# EAGLE schematic SparkFun_Main_Board_Single_v20 (EAGLE 9.6.2)
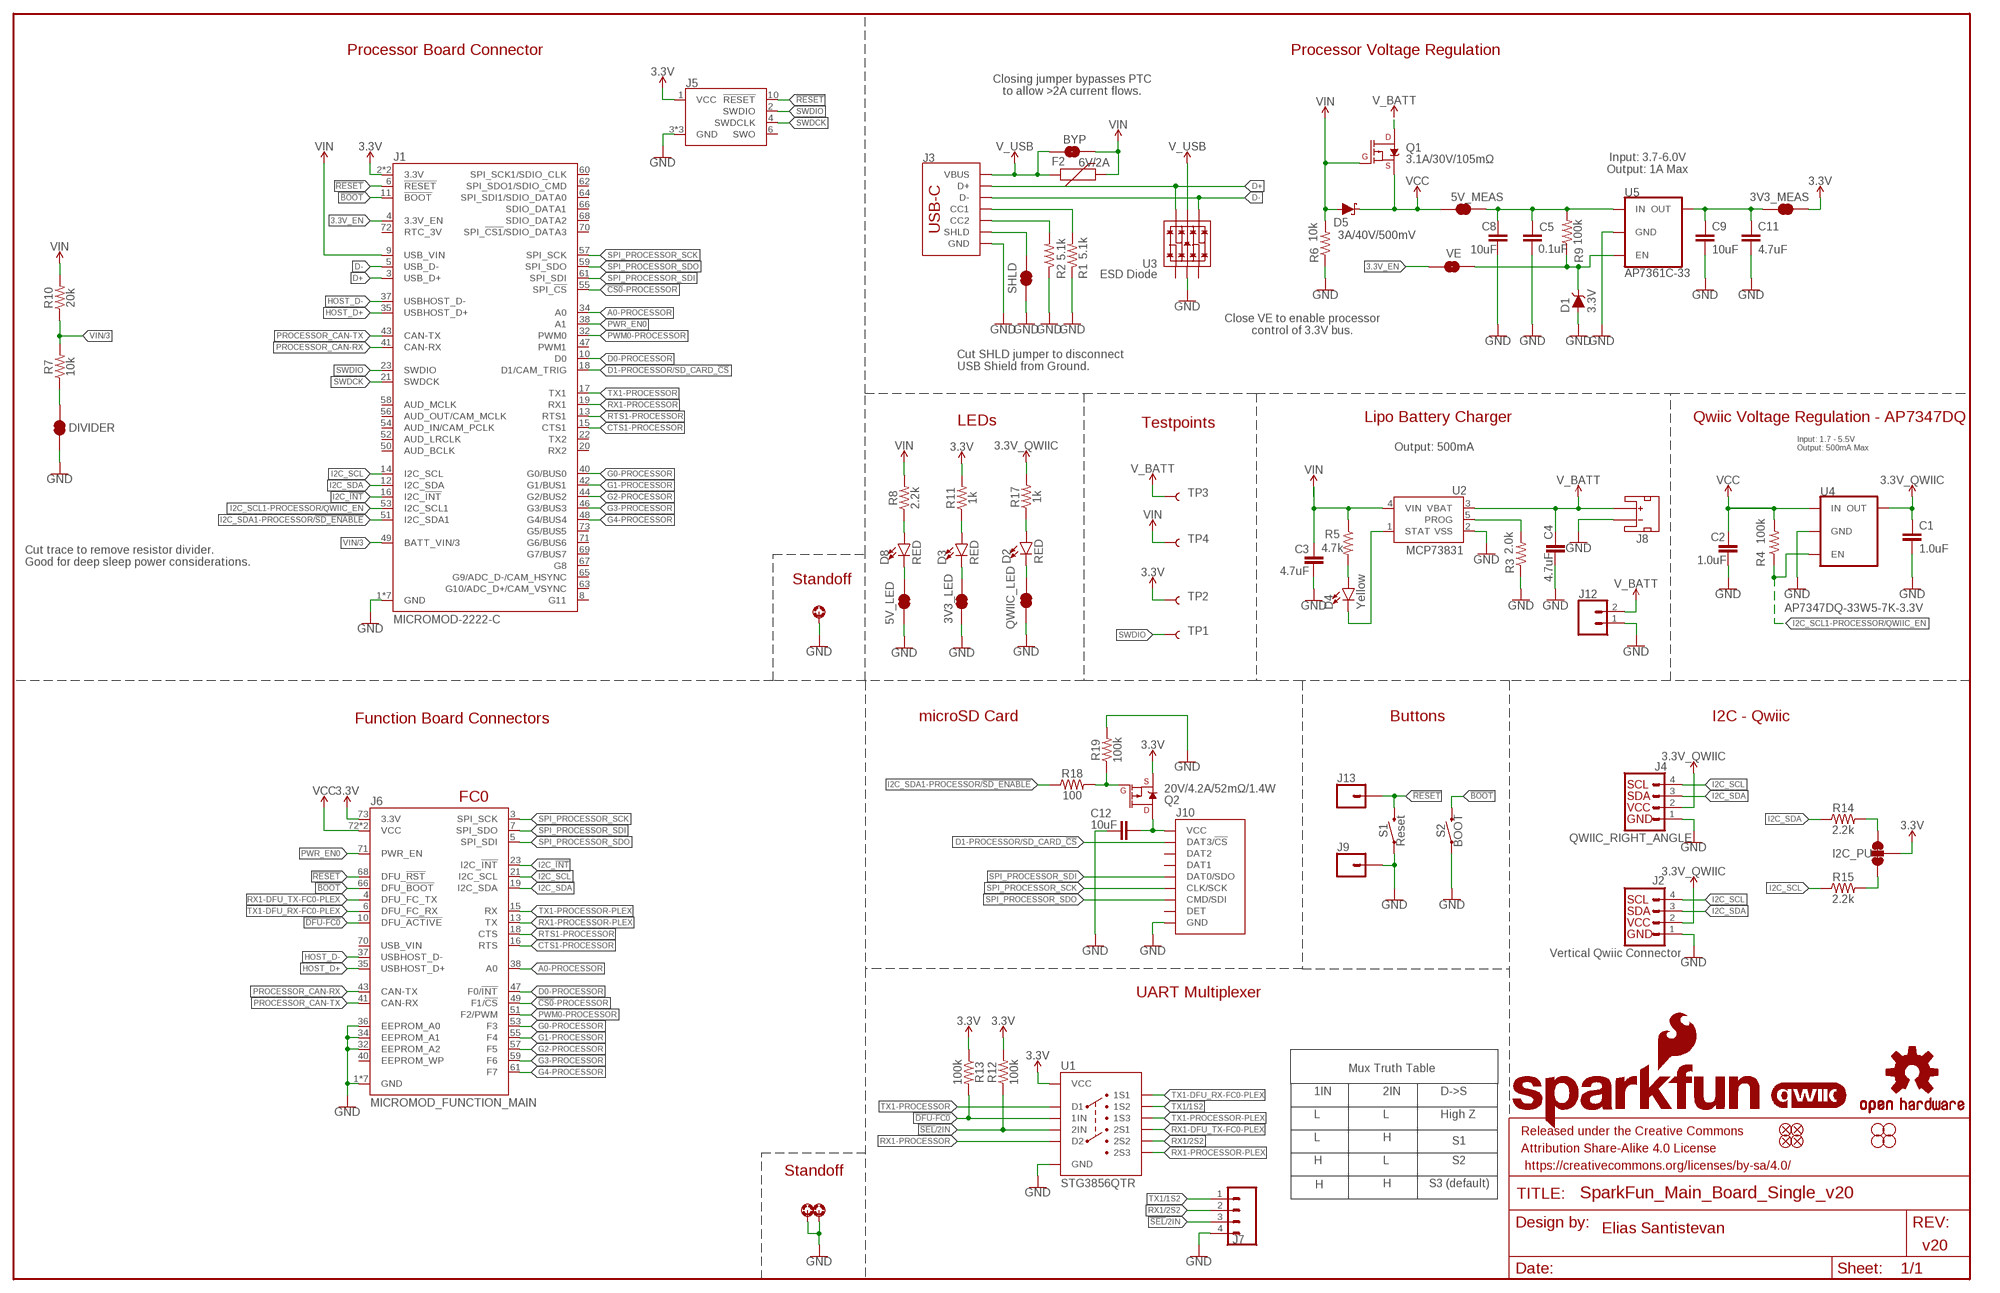
[diagram p0: schematic, sheet 1]

## Parts
3V3_LED  JUMPER-SMT_2_NC_TRACE_SILK  [SMT-JUMPER_2_NC_TRACE_SILK]
3V3_MEAS  JUMPER-COMBO_2_NC_TRACE  [COMBO-JUMPER_2_NC_TRACE]
5V_LED  JUMPER-SMT_2_NC_TRACE_SILK  [SMT-JUMPER_2_NC_TRACE_SILK]
5V_MEAS  JUMPER-COMBO_2_NC_TRACE  [COMBO-JUMPER_2_NC_TRACE]
BYP  JUMPER-SMT_2_NO_SILK  [SMT-JUMPER_2_NO_SILK]
C1  1.0uF  1.0UF-0603-16V-10%  [0603]
C2  1.0uF  1.0UF-0603-16V-10%  [0603]
C3  4.7uF  4.7UF-0603-6.3V-(10%)  [0603]
C4  4.7uF  4.7UF-0603-35V-(20%)  [0603]
C5  0.1uF  0.1UF-0603-25V-(+80/-20%)  [0603]
C8  10uF  10UF-0805-10V-10%  [0805]
C9  10uF  10UF-0603-6.3V-20%  [0603]
C11  4.7uF  4.7UF-0603-6.3V-(10%)  [0603]
C12  10uF  10UF-0603-6.3V-20%  [0603]
D1  3.3V  DIODE-ZENER-MM3Z3V3T1G  [SOD-323]
D2  RED  LED-RED0603  [LED-0603]
D3  RED  LED-RED0603  [LED-0603]
D4  Yellow  LED-YELLOW0603  [LED-0603]
D5  3A/40V/500mV  DIODE-SCHOTTKY-B340A  [SMA-DIODE]
D8  RED  LED-RED0603  [LED-0603]
DIVIDER  JUMPER-SMT_2_NC_TRACE_SILK  [SMT-JUMPER_2_NC_TRACE_SILK]
F2  6V/2A  PPTC_6V2A  [1210]
FD1  FIDUCIAL1X2  [FIDUCIAL-1X2]
FD2  FIDUCIAL1X2  [FIDUCIAL-1X2]
FD3  FIDUCIAL1X2  [FIDUCIAL-1X2]
FD4  FIDUCIAL1X2  [FIDUCIAL-1X2]
FRAME1  FRAME-LEDGER  [CREATIVE_COMMONS]
H2  STAND-OFF-REFLOW-M2.5_2.5MM_TALL  [STAND-OFF-REFLOW-M2.5]
H4  STAND-OFF-REFLOW-M2.5_2.5MM_TALL  [STAND-OFF-REFLOW-M2.5]
H8  STAND-OFF-REFLOW-M2.5_2.5MM_TALL  [STAND-OFF-REFLOW-M2.5]
H14  STAND-OFFTIGHT  [STAND-OFF-TIGHT]
H15  STAND-OFFTIGHT  [STAND-OFF-TIGHT]
H16  STAND-OFFTIGHT  [STAND-OFF-TIGHT]
H17  STAND-OFFTIGHT  [STAND-OFF-TIGHT]
I2C_PU  JUMPER-SMT_3_2-NC_TRACE_SILK  [SMT-JUMPER_3_2-NC_TRACE_SILK]
J1  MICROMOD-2222-C  [M.2-CONNECTOR-E]
J2  Vertical Qwiic Connector  QWIIC_CONNECTOR  [JST04_1MM_VERT]
J3  USB_C_2-LAYER_PADS  [USB-C-16P-2LAYER-PADS]
J4  QWIIC_RIGHT_ANGLE  QWIIC_CONNECTORJS-1MM  [JST04_1MM_RA]
J5  CORTEX_JTAG_DEBUG_MINIMUM_PTH  [2X5-PTH-1.27MM]
J6  MICROMOD_FUNCTION_MAIN  [M.2-CONNECTOR-E-FUNCTION-STANDARD]
J7  CONN_041X04_NO_SILK  [1X04_NO_SILK]
J8  JST_2MM_MALE  [JST-2-SMD]
J9  CONN_01PTH_NO_SILK_YES_STOP  [1X01_NO_SILK]
J10  MICRO-SD-PUSH-PUSH-EXT-PIN  [MICROSD-EXTERNALPIN]
J12  CONN_021X02_NO_SILK  [1X02_NO_SILK]
J13  CONN_01PTH_NO_SILK_YES_STOP  [1X01_NO_SILK]
LOGO1  QWIIC_LOGO_8MM  [QWIIC_8MM]
LOGO2  SFE_LOGO_NAME_FLAME.3_INCH  [SFE_LOGO_NAME_FLAME_.3]
LOGO3  OSHW-LOGOL  [OSHW-LOGO-L]
Q1  3.1A/30V/105mΩ  MOSFET_PCH-DMG2307L  [SOT23-3]
Q2  20V/4.2A/52mΩ/1.4W  MOSFET_PCH-DMG2305UX-7  [SOT23-3]
QWIIC_LED  JUMPER-SMT_2_NC_TRACE_SILK  [SMT-JUMPER_2_NC_TRACE_SILK]
R1  5.1k  5.1KOHM5.1KOHM-0603-1/10W-1%  [0603]
R2  5.1k  5.1KOHM5.1KOHM-0603-1/10W-1%  [0603]
R3  2.0k  2.0KOHM-0603-1/10W-5%  [0603]
R4  100k  100KOHM-0603-1/10W-1%  [0603]
R5  4.7k  4.7KOHM-0603-1/10W-1%  [0603]
R6  10k  10KOHM-0603-1/10W-1%  [0603]
R7  10k  10KOHM-0603-1/10W-1%  [0603]
R8  2.2k  2.2KOHM-0603-1/10W-1%  [0603]
R9  100k  100KOHM-0603-1/10W-1%  [0603]
R10  20k  20KOHM-0603-1/10W-1%  [0603]
R11  1k  1KOHM-0603-1/10W-1%  [0603]
R12  100k  100KOHM-0603-1/10W-1%  [0603]
R13  100k  100KOHM-0603-1/10W-1%  [0603]
R14  2.2k  2.2KOHM-0603-1/10W-1%  [0603]
R15  2.2k  2.2KOHM-0603-1/10W-1%  [0603]
R17  1k  1KOHM-0603-1/10W-1%  [0603]
R18  100  100OHM-0603-1/10W-1%  [0603]
R19  100k  100KOHM-0603-1/10W-1%  [0603]
S1  Reset  MOMENTARY-SWITCH-SPST-SMD-5.2-TALL-REDUNDANT  [TACTILE_SWITCH_SMD_5.2MM]
S2  BOOT  MOMENTARY-SWITCH-SPST-SMD-5.2-TALL-REDUNDANT  [TACTILE_SWITCH_SMD_5.2MM]
SHLD  JUMPER-SMT_2_NC_TRACE_SILK  [SMT-JUMPER_2_NC_TRACE_SILK]
TP1  TEST-POINT3X5  [PAD.03X.05]
TP2  TEST-POINT3X5  [PAD.03X.05]
TP3  TEST-POINT3X5  [PAD.03X.05]
TP4  TEST-POINT3X5  [PAD.03X.05]
U1  STG3856QTR  [STG3856]
U2  MCP73831  [SOT23-5]
U3  ESD Diode  TVS_DIODE_ARRAYSMD  [SOT-23-6]
U4  AP7347DQ-33W5-7K-3.3V  [SOT25]
U5  AP7361C-33  AP7361C-33FGEUDFN-8  [UDFN-8]
VE  JUMPER-SMT_2_NO_SILK  [SMT-JUMPER_2_NO_SILK]

## Nets
3.3V [POWER]: 3V3_MEAS.2 3V3_MEAS.4 I2C_PU.2 J1.2(3.3V) J1.74(3.3V) J5.1(VCC) J6.73(3.3V) Q2.2(S) R11.2 R12.2 R13.1 TP2.1 U1.P11(VCC)
3.3V_EN: J1.4(3.3V_EN) VE.1
3.3V_EN_VE: D1.C R9.1 U5.5(EN) VE.2
3.3V_QWIIC: C1.1 J2.2 J4.2 R17.2 U4.5(OUT)
3V3_MEAS: 3V3_MEAS.1 3V3_MEAS.3 C9.1 C11.1 U5.1(OUT)
!BOOT!: J1.11(!BOOT!) J6.66(DFU_!BOOT!) S2.3 S2.4
!CS0!-PROCESSOR: J1.55(SPI_!CS!) J6.49(F1/!CS!)
!DFU-FC0!: J6.10(DFU_!ACTIVE!) R13.2 U1.P12(1IN)
!RESET!: J1.6(!RESET!) J5.10(!RESET) J6.68(DFU_!RST!) J13.1 S1.3 S1.4
!SEL!/2IN: J7.3 R12.1 U1.P10(2IN)
A0-PROCESSOR: J1.34(A0) J6.38(A0)
CTS1-PROCESSOR: J1.15(CTS1) J6.16(RTS)
D0-PROCESSOR: J1.10(D0) J6.47(F0/!INT!)
D1-PROCESSOR/SD_CARD_!CS!: J1.18(D1/CAM_TRIG) J10.2(DAT3/!CS!)
D+ [Diff pairs]: J1.3(USB_D+) J3.A6(D+) J3.B6(D+) U3.6(IO4)
D- [Diff pairs]: J1.5(USB_D-) J3.A7(D-) J3.B7(D-) U3.4(IO3)
G0-PROCESSOR: J1.40(G0/BUS0) J6.53(F3)
G1-PROCESSOR: J1.42(G1/BUS1) J6.55(F4)
G2-PROCESSOR: J1.44(G2/BUS2) J6.57(F5)
G3-PROCESSOR: J1.46(G3/BUS3) J6.59(F6)
G4-PROCESSOR: J1.48(G4/BUS4) J6.61(F7)
GND: 3V3_LED.1 5V_LED.1 C1.2 C2.2 C3.2 C4.2 C5.2 C8.2 C9.2 C11.2 C12.2 D1.A DIVIDER.1 H2.1 H4.1 H8.1 J1.1(GND) J1.7(GND) J1.33(GND) J1.36(GND) J1.39(GND) J1.45(GND) J1.75(GND) J2.1 J3.GND J3.GND2(GND) J4.1 J5.3(GND) J5.5(GND) J5.9(GND) J6.1(GND) J6.2(GND) J6.8(GND) J6.32(EEPROM_A2) J6.33(GND) J6.34(EEPROM_A1) J6.36(EEPROM_A0) J6.39(GND) J6.45(GND) J6.75(GND) J7.4 J8.1(-) J9.1 J10.6(GND) J10.10(GND) J10.11(GND) J10.12(GND) J10.13(GND) J12.1 QWIIC_LED.1 R1.1 R2.1 R3.1 R6.1 R19.2 S1.1 S1.2 S2.1 S2.2 SHLD.1 U1.P5(GND) U2.2(VSS) U3.2(VSS) U4.2(GND) U5.4(GND) U5.EP(GND)
HOST_D+ [Diff pairs]: J1.35(USBHOST_D+) J6.35(USBHOST_D+)
HOST_D- [Diff pairs]: J1.37(USBHOST_D-) J6.37(USBHOST_D-)
I2C_!INT!: J1.16(I2C_!INT!) J6.23(I2C_!INT!)
I2C_SCL: J1.14(I2C_SCL) J2.4 J4.4 J6.21(I2C_SCL) R15.1
I2C_SCL1-PROCESSOR/QWIIC_EN: J1.53(I2C_SCL1) R4.1 U4.3(EN)
I2C_SDA: J1.12(I2C_SDA) J2.3 J4.3 J6.19(I2C_SDA) R14.1
I2C_SDA1-PROCESSOR/!SD_ENABLE!: J1.51(I2C_SDA1) R18.1
N$2: 5V_LED.2 D8.C
N$3: D3.A R11.1
N$4: J3.B5(CC2) R2.2
N$5: J3.A5(CC1) R1.2
N$6: R3.2 U2.5(PROG)
N$7: DIVIDER.2 R7.1
N$8: D4.C U2.1(STAT)
N$9: D4.A R5.2
N$10: 3V3_LED.2 D3.C
N$11: I2C_PU.3 R14.2
N$12: D8.A R8.1
N$13: I2C_PU.1 R15.2
N$14: D2.A R17.1
N$15: D2.C QWIIC_LED.2
N$16 [POWER]: C12.1 J10.4(VCC) Q2.3(D)
N$18: Q2.1(G) R18.2 R19.1
PROCESSOR_CAN-RX: J1.41(CAN-RX) J6.43(CAN-TX)
PROCESSOR_CAN-TX: J1.43(CAN-TX) J6.41(CAN-RX)
PWM0-PROCESSOR: J1.32(PWM0) J6.51(F2/PWM)
PWR_EN0: J1.38(A1) J6.71(PWR_EN)
RTS1-PROCESSOR: J1.13(RTS1) J6.18(CTS)
RX1-DFU_TX-FC0-PLEX: J6.4(DFU_FC_TX) U1.P9(2S1)
RX1-PROCESSOR: J1.19(RX1) U1.P6(D2)
RX1-PROCESSOR-PLEX: J6.13(TX) U1.P7(2S3)
RX1/2S2: J7.2 U1.P8(2S2)
SHLD: J3.SHLD1(SHLD) J3.SHLD2(SHLD) J3.SHLD3(SHLD) J3.SHLD4(SHLD) SHLD.2
SPI_PROCESSOR_SCK: J1.57(SPI_SCK) J6.3(SPI_SCK) J10.5(CLK/SCK)
SPI_PROCESSOR_SDI: J1.61(SPI_SDI) J6.7(SPI_SDO) J10.7(DAT0/SDO)
SPI_PROCESSOR_SDO: J1.59(SPI_SDO) J6.5(SPI_SDI) J10.3(CMD/SDI)
SWDCK: J1.21(SWDCK) J5.4(SWDCLK)
SWDIO: J1.23(SWDIO) J5.2(SWDIO) TP1.1
TX1-DFU_RX-FC0-PLEX: J6.6(DFU_FC_RX) U1.P1(1S1)
TX1-PROCESSOR: J1.17(TX1) U1.P4(D1)
TX1-PROCESSOR-PLEX: J6.15(RX) U1.P3(1S3)
TX1/1S2: J7.1 U1.P2(1S2)
V_BATT [POWER]: C4.1 J8.2(+) J12.2 Q1.3(D) TP3.1 U2.3(VBAT)
V_USB: BYP.1 F2.1 J3.VBUS1(VBUS) J3.VBUS2(VBUS) U3.5(VCC)
VCC: 5V_MEAS.1 5V_MEAS.3 C2.1 D5.C J6.72(VCC) J6.74(VCC) Q1.2(S) R4.2 U4.1(IN)
VCC_MEAS: 5V_MEAS.2 5V_MEAS.4 C5.1 C8.1 R9.2 U5.8(IN)
VIN: BYP.2 C3.1 D5.A F2.2 J1.9(USB_VIN) Q1.1(G) R5.1 R6.2 R8.2 R10.2 TP4.1 U2.4(VIN)
VIN/3: J1.49(BATT_VIN/3) R7.2 R10.1
Unconnected: J1.8(G11) J1.20(RX2) J1.22(TX2) J1.47(PWM1) J1.50(AUD_BCLK) J1.52(AUD_LRCLK) J1.54(AUD_IN/CAM_PCLK) J1.56(AUD_OUT/CAM_MCLK) J1.58(AUD_MCLK) J1.60(SPI_SCK1/SDIO_CLK) J1.62(SPI_SDO1/SDIO_CMD) J1.63(G10/ADC_D+/CAM_VSYNC) J1.64(SPI_SDI1/SDIO_DATA0) J1.65(G9/ADC_D-/CAM_HSYNC) J1.66(SDIO_DATA1) J1.67(G8) J1.68(SDIO_DATA2) J1.69(G7/BUS7) J1.70(SPI_!CS1!/SDIO_DATA3) J1.71(G6/BUS6) J1.72(RTC_3V) J1.73(G5/BUS5) J5.6(SWO) J6.40(EEPROM_WP) J6.70(USB_VIN) J8.NC1(PAD1) J8.NC2(PAD2) J10.1(DAT2) J10.8(DAT1) J10.9(DET) U3.1(IO1) U3.3(IO2)

## Notes on the sheet
- Processor Board Connector | Processor Voltage Regulation
- Closing jumper bypasses PTC
  to allow >2A current flows.
- Input: 3.7-6.0V
  Output: 1A Max
- Close VE to enable processor
  control of 3.3V bus.
- Cut SHLD jumper to disconnect
  USB Shield from Ground.
- Lipo Battery Charger | Qwiic Voltage Regulation - AP7347DQ
- LEDs | Testpoints
- Output: 500mA
- Input: 1.7 - 5.5V
  Output: 500mA Max
- Cut trace to remove resistor divider.
  Good for deep sleep power considerations.
- Standoff
- Function Board Connectors | microSD Card | Buttons | I2C - Qwiic
- FC0
- UART Multiplexer
- Mux Truth Table
- 1IN | 2IN | D->S
- L | L | High Z
- L | H
- S1
- H | L | S2
- Standoff
- H | H | S3 (default)
- Elias Santistevan
- v20

## Library data of the parts
3V3_LED 5V_LED DIVIDER QWIIC_LED SHLD = SparkFun-Jumpers:JUMPER-SMT_2_NC_TRACE: Normally closed trace jumper This jumper has a trace between two pads so it's normally closed (NC). Use a razor knife to open the connection. For best results follow the IPC guidelines for cutting traces: Cutout at least 0.063 mm (0.005 in). Remove all loose material to clean up the cut area. Seal the cut with an approved epoxy. Reapply solder to reclose the connection.
3V3_MEAS 5V_MEAS = SparkFun-Jumpers:JUMPER-COMBO_2_NC_TRACE
BYP VE = SparkFun-Jumpers:JUMPER-SMT_2_NO: Normally open jumper This jumper has two pads in close proximity to each other. Apply solder to close the connection. Round pads are easier to solder for beginners, but are a lot larger. SparkFun Product that uses the round pads: SparkFun EL Sequencer <https://www.sparkfun.com/products/12781>
C1 C2 = SparkFun-Capacitors:1.0UF: 1µF ceramic capacitors A capacitor is a passive two-terminal electrical component used to store electrical energy temporarily in an electric field.; PROD_ID: CAP-00868
C3 C11 = SparkFun-Capacitors:4.7UF: 4.7µF ceramic capacitors A capacitor is a passive two-terminal electrical component used to store electrical energy temporarily in an electric field.; PROD_ID: CAP-08280
C4 = SparkFun-Capacitors:4.7UF: 4.7µF ceramic capacitors A capacitor is a passive two-terminal electrical component used to store electrical energy temporarily in an electric field.; PROD_ID: CAP-14106
C5 = SparkFun-Capacitors:0.1UF: 0.1µF ceramic capacitors A capacitor is a passive two-terminal electrical component used to store electrical energy temporarily in an electric field.; PROD_ID: CAP-00810
C8 = SparkFun-Capacitors:10UF: 10.0µF ceramic capacitors A capacitor is a passive two-terminal electrical component used to store electrical energy temporarily in an electric field.; PROD_ID: CAP-11330
C9 C12 = SparkFun-Capacitors:10UF: 10.0µF ceramic capacitors A capacitor is a passive two-terminal electrical component used to store electrical energy temporarily in an electric field.; PROD_ID: CAP-11015
D1 = SparkFun-DiscreteSemi:DIODE-ZENER: Zener Diode A Zener diode allows current to flow from its anode to its cathode like a normal semiconductor diode, but it also permits current to flow in the reverse direction when its "Zener voltage" is reached. - WIkipedia; PROD_ID: DIO-11284
D2 D3 D8 = SparkFun-LED:LED-RED: Red SMD LED Used in manufacturing of most products at SparkFun Packages: 0603 - SMD 0603 package [Product Link] <http://docs.avagotech.com/docs/AV02-0551EN> 0603 SMART - SMD 0603 SMART package ( more efficient and expensive)[Product Link] <http://www.osram-os.com/Graphics/XPic2/00077099_0.pdf> 1206 - SMD1206 package [Product Link] <https://www.sparkfun.com/datasheets/DevTools/LilyPad/Q150OVS4.pdff> SparkFun Products: Pro Mini 328 -5V <https://www.sparkfun.com/products/821> RedBoard <https://www.sparkfun.com/products/12757> IOIO-OTG <https://www.sparkfun.com/products/13613>; PROD_ID: DIO-00819
D4 = SparkFun-LED:LED-YELLOW: Yellow SMD LED Used in manufacturing several products at SparkFun. Packages: 0603 - SMD 0603 package[Product Link] <http://www.kingbrightusa.com/product.asp?catalog_name=LED&product_id=APT1608SYCK> 0603 -SMART - SMART SMD 0603 package (more efficient/more expensive) [Product Link] <http://www.osram-os.com/osram_os/en/products/product-catalog/led-light-emitting-diodes/smartled-0603/ly-l29k/index.jsp> LilyPad - SMD1206 package[Product Datasheet] <https://www.sparkfun.com/datasheets/DevTools/LilyPad/Q150YUS4.pdf> SparkFun Products: Blynk Board <https://www.sparkfun.com/products/13794> IOIO-OTG <https://www.sparkfun.com/products/13613> XBee Explorer Serial <https://www.sparkfun.com/products/13225>; PROD_ID: DIO-09003
D5 = SparkFun-DiscreteSemi:DIODE-SCHOTTKY: Schottky diode A Schottky diode is a semiconductor diode which has a low forward voltage drop and a very fast switching action.; PROD_ID: DIO-09886
F2 = SparkFun-Fuses:PPTC: Resettable Fuse PPTC Resettable Fuse. Really a sort of resistor with a polymeric positive temperature coefficient whose resistance increases dramatically with an increase in temperature. When heated by the power passing through the resistance rises causing the current to be limited, protecting the circuit. This is achieved by the transition of the polymer from a crystalline to an amorphous state where the conductive carbon separates breaking the conductive pathways found in the cool crystalline structure. When a PPTC cools back down it resumes conducting letting the circuit turn back on. SparkFun Products: SparkFun RedBoard - Programmed with Arduino <https://www.sparkfun.com/products/12757> Pro Micro - 5V/16MHz <https://www.sparkfun.com/products/12640> Arduino Pro 328 - 5V/16MHz <https://www.sparkfun.com/products/10915> MP3 Trigger <https://www.sparkfun.com/products/13720>; PROD_ID: RES-14313
FD1-FD4 = SparkFun-Aesthetics:FIDUCIAL: Fiducial Alignment Points Point-of-reference for pick-and-place machines and other optical instruments.
FRAME1 = SparkFun-Aesthetics:FRAME-LEDGER: Schematic Frame - Ledger Standard 11x14 US Ledger frame
H2 H4 H8 = SparkFun-Hardware:STAND-OFF-REFLOW: Stand Off Reflow Compatible A metal standoff that can be placed and reflowed onto a PCB. The M2.5 x 2.5mm variant is used on MicroMod. The M2.5 x 1.5mm variant is used to hold mPCIe boards, including the Swarm M138. The M2.0 x 6.0mm variant is used to mount the Iridium 9603N modem.; PROD_ID: HW-14899
H14-H17 = SparkFun-Hardware:STAND-OFF: Stand Off Drill holes for mechanically mounting via screws, standoffs, etc. Note: Use the keepout ring to avoid running the screw head into surrounding components. Variant Overviews STAND-OFF - Mechanical footprint for a #4 phillips button head screw. STAND-OFF-TIGHT - Mechanical footprint for a #4 phillips button head screw, Example SparkFun Products Screw - Phillips Head (1/4", 4-40, 10 pack) <https://www.sparkfun.com/products/10453> (PRT-10453) Screw - Phillips Head (1/2", 4-40, 10 pack) <https://www.sparkfun.com/products/10452> (PRT-10452) Screw - Phillips Head (3/4", 4-40, 10 pack) <https://www.sparkfun.com/products/10451> (PRT-10451) Screw - Phillips Head (1", 4-40, 10 pack) <https://www.sparkfun.com/products/10450> (PRT-10450)
I2C_PU = SparkFun-Jumpers:JUMPER-SMT_3_2-NC_TRACE: Normally closed trace jumper (2 of 2 connections) This jumper has a trace between all three pads so they are normally closed (NC). Use a razor knife to open the connection(s). For best results follow the IPC guidelines for cutting traces: Cutout at least 0.063 mm (0.005 in). Remove all loose material to clean up the cut area. Seal the cut with an approved epoxy. Reapply solder to reclose the connection(s).
J1 = SparkFun-MicroMod:MICROMOD: MicroMod Connector Description: A card edge connector and mating PCB connector to allow various MicroMod Processor Boards to be coupled with various carrier boards of different capabilities. Based on the M.2 standard.; PROD_ID: CONN-14877
J2 = SparkFun-Connectors:QWIIC_CONNECTOR: SparkFun I2C Standard Qwiic Connector An SMD 1mm pitch JST connector makes it easy and quick (get it? Qwiic?) to connect I2C devices to each other. The Qwiic system <http://www.sparkfun.com/qwiic> enables fast and solderless connection between popular platforms and various sensors and actuators. We carry 200mm <https://www.sparkfun.com/products/14204>, 100mm <https://www.sparkfun.com/products/14205>, 50mm <https://www.sparkfun.com/products/14206>, and breadboard friendly <https://www.sparkfun.com/products/14207> Qwiic cables. We also offer 10 pcs strips <https://www.sparkfun.com/products/14323> the SMD connectors.; PROD_ID: CONN-14483
J3 = SparkFun-Connectors:USB_C: USB Type C 16Pin Connector Super Speed pins not available on the 16-pin purely SMD connector so this part is best for USB 2.0 implementations. D1 and D2 are tied together enabling D+/- no matter which way the cable is plugged into the connector. The two channel configuration pins (CC1/2) are exposed. These are normally connected to ground via 5.1k resistors but can be reconfigured for high current/high power applications. **4-LAYER BOARD WARNING!!** If designing 4-layer board, make sure to select the variant _4-LAYER-ISOLATED. The linked footprint (USB-C-16-4LAYER-ISOLATED) includes some very necessary cutout polygons in the inner layers (2 and 15). This prevents the PTH mounting shield legs on the USB connector from electrically connecting any other polygons on the inner layers (usually VCC and GND).; PROD_ID: CONN-14122
J4 = SparkFun-Connectors:QWIIC_CONNECTOR: SparkFun I2C Standard Qwiic Connector An SMD 1mm pitch JST connector makes it easy and quick (get it? Qwiic?) to connect I2C devices to each other. The Qwiic system <http://www.sparkfun.com/qwiic> enables fast and solderless connection between popular platforms and various sensors and actuators. We carry 200mm <https://www.sparkfun.com/products/14204>, 100mm <https://www.sparkfun.com/products/14205>, 50mm <https://www.sparkfun.com/products/14206>, and breadboard friendly <https://www.sparkfun.com/products/14207> Qwiic cables. We also offer 10 pcs strips <https://www.sparkfun.com/products/14323> the SMD connectors.; PROD_ID: CONN-13694
J5 = SparkFun-Connectors:CORTEX_JTAG_DEBUG_MINIMUM: Cortex Debug Connector - 10 pin Supports JTAG debug, Serial Wire debug, and Serial Wire Viewer. PTH and SMD connector options available. General Connector Information <http://infocenter.arm.com/help/topic/com.arm.doc.faqs/attached/13634/cortex_debug_connectors.pdf> Products: PTH Connector <http://www.digikey.com/product-detail/en/cnc-tech/3220-10-0100-00/1175-1627-ND/3883661> -via Digi-Key SparkFun PSoc <https://www.sparkfun.com/products/13229> SparkFun T <https://www.sparkfun.com/products/13810>
J6 = SparkFun-MicroMod:MICROMOD_FUNCTION: MicroMod Connector Description: A card edge connector and mating PCB connector to allow various MicroMod Processor Boards to be coupled with various carrier boards of different capabilities. Based on the M.2 standard.; PROD_ID: CONN-14877
J7 = SparkFun-Connectors:CONN_04: Multi connection point. Often used as Generic Header-pin footprint for 0.1 inch spaced/style header connections On any of the 0.1 inch spaced packages, you can populate with these: Break Away Headers - Straight <https://www.sparkfun.com/products/116> (PRT-00116) Break Away Male Headers - Right Angle <https://www.sparkfun.com/products/553> (PRT-00553) Female Headers <https://www.sparkfun.com/products/115> (PRT-00115) Break Away Headers - Machine Pin <https://www.sparkfun.com/products/117> (PRT-00117) Break Away Female Headers - Swiss Machine Pin <https://www.sparkfun.com/products/743> (PRT-00743) For SCREWTERMINALS and SPRING TERMINALS visit here: Screw Terimnals on SparkFun.com <https://www.sparkfun.com/search/results?term=Screw+Terminals> (5mm/3.5mm/2.54mm spacing) This device is also useful as a general connection point to wire up your design to another part of your project. Our various solder wires solder well into these plated through hole pads. Hook-Up Wire - Assortment (Stranded, 22 AWG) <https://www.sparkfun.com/products/11375> (PRT-11375) Hook-Up Wire - Assortment (Solid Core, 22 AWG) <https://www.sparkfun.com/products/11367> (PRT-11367) View the entire wire category on our website here <https://www.sparkfun.com/categories/141> Special notes: Molex polarized connector foot print use with SKU : PRT-08231 with associated crimp pins and housings. 1MM SMD Version SKU: PRT-10208; PROD_ID: CONN-09696
J8 = SparkFun-Connectors:JST_2MM_MALE: JST 2MM MALE RA CONNECTOR Two pin, compact surface mount connector. Commonly used as a battery input connection point. We really like the solid locking feeling and high current rating on these small connectors. We use these all the time as battery connectors. Mates to single-cell LiPo batteries. Here is the connector we sell at SparkFun: JST Right Angle Connector - White <https://www.sparkfun.com/products/8612> (PRT-08612) Datasheet <http://www.sparkfun.com/datasheets/Prototyping/Connectors/JST-Horizontal.pdf> It was used on these SparkFun products: SparkFun MOSFET Power Controller <https://www.sparkfun.com/products/11214> (PRT-11214) SparkFun Battery Babysitter - LiPo Battery Manager <https://www.sparkfun.com/products/13777> (PRT-13777) And many, many others that required a lipo battery connection.; PROD_ID: CONN-11443; SF_ID: PRT-08612
J9 J13 = SparkFun-Connectors:CONN_01: Single connection point. Often used as Generic Header-pin footprint for 0.1 inch spaced/style header connections On any of the 0.1 inch spaced packages, you can populate with these: Break Away Headers - Straight <https://www.sparkfun.com/products/116> (PRT-00116) Break Away Male Headers - Right Angle <https://www.sparkfun.com/products/553> (PRT-00553) Female Headers <https://www.sparkfun.com/products/115> (PRT-00115) Break Away Headers - Machine Pin <https://www.sparkfun.com/products/117> (PRT-00117) Break Away Female Headers - Swiss Machine Pin <https://www.sparkfun.com/products/743> (PRT-00743) This device is also useful as a general connection point to wire up your design to another part of your project. Our various solder wires solder well into these plated through hole pads. Hook-Up Wire - Assortment (Stranded, 22 AWG) <https://www.sparkfun.com/products/11375> (PRT-11375) Hook-Up Wire - Assortment (Solid Core, 22 AWG) <https://www.sparkfun.com/products/11367> (PRT-11367) View the entire wire category on our website here <https://www.sparkfun.com/categories/141> Special notes: SMTSO-256-ET is a "flush mount" nut for a 4-40 screw. We mostly use this on specialty testbeds; it is a nice way to connect hardware to your PCB at an adjustable hieght. Also note, the SNAP packages are for using a snappable style connector. We sell a baggie of snaps and they are also used on two LilyPad designs: Snap Assortment - 30 pack (male and female) <https://www.sparkfun.com/products/11347> (DEV-11347) LilyPad Arduino SimpleSnap <https://www.sparkfun.com/products/10941> (DEV-10941) LilyPad SimpleSnap Protoboard <https://www.sparkfun.com/products/10940> (DEV-10940)
J10 = SparkFun-Connectors:MICRO-SD: microSD Socket for Transflash Various sockets for µSD. tDoc lines correctly indicate media card edge positions when inserting (unlocked, locked, depressed). NOTE: CD1 and CD2 are connected internally, and the default detect state of the socket is detect pin to ground. SparkFun Products: WAV Trigger <https://www.sparkfun.com/products/13660> CAN-Bus Shield <https://www.sparkfun.com/products/13262> SparkFun Level Shifing microSD Breakout <https://www.sparkfun.com/products/13743>; PROD_ID: CONN-16110
J12 = SparkFun-Connectors:CONN_02: Multi connection point. Often used as Generic Header-pin footprint for 0.1 inch spaced/style header connections On any of the 0.1 inch spaced packages, you can populate with these: Break Away Headers - Straight <https://www.sparkfun.com/products/116> (PRT-00116) Break Away Male Headers - Right Angle <https://www.sparkfun.com/products/553> (PRT-00553) Female Headers <https://www.sparkfun.com/products/115> (PRT-00115) Break Away Headers - Machine Pin <https://www.sparkfun.com/products/117> (PRT-00117) Break Away Female Headers - Swiss Machine Pin <https://www.sparkfun.com/products/743> (PRT-00743) For SCREWTERMINALS and SPRING TERMINALS visit here: Screw Terimnals on SparkFun.com <https://www.sparkfun.com/search/results?term=Screw+Terminals> (5mm/3.5mm/2.54mm spacing) This device is also useful as a general connection point to wire up your design to another part of your project. Our various solder wires solder well into these plated through hole pads. Hook-Up Wire - Assortment (Stranded, 22 AWG) <https://www.sparkfun.com/products/11375> (PRT-11375) Hook-Up Wire - Assortment (Solid Core, 22 AWG) <https://www.sparkfun.com/products/11367> (PRT-11367) View the entire wire category on our website here <https://www.sparkfun.com/categories/141> Special notes: Molex polarized connector foot print use with: PRT-08233 with associated crimp pins and housings. 2.54_SCREWTERM for use with PRT-10571. 3.5mm Screw Terminal footprints for PRT-08084 5mm Screw Terminal footprints for use with PRT-08432
LOGO1 = SparkFun-Aesthetics:QWIIC_LOGO: Qwiic Logos for placement on schematic and PCB. The 5.5mm silk logo is best for placing next to Qwiic connector.
LOGO2 = SparkFun-Aesthetics:SFE_LOGO_NAME_FLAME: SparkFun Font Logo w/ Flame This is the SparkFun full logo. The logo on the schematic will always be the same size; the package variant is the height of the flame part of the logo. Default layer for the logo on the board is tSilk.
LOGO3 = SparkFun-Aesthetics:OSHW-LOGO: Open-Source Hardware (OSHW) Logo This logo indicates the piece of hardware it is found on incorporates a OSHW license and/or adheres to the definition of open source hardware found here: http://freedomdefined.org/OSHW
Q1 = SparkFun-DiscreteSemi:MOSFET_PCH: P-channel MOSFETs Voltage controlled devices that allow control of high current outputs. SparkFun Products: SparkFun ESP32 Thing <https://www.sparkfun.com/products/13907> SparkFun ESP8266 Thing <https://www.sparkfun.com/products/13231> SparkFun Pi Servo HAT V2 <https://www.sparkfun.com/products/15316> DMG2305UX-7 (20V/4.2A/SOT23-3); PROD_ID: TRANS-11308
Q2 = SparkFun-DiscreteSemi:MOSFET_PCH: P-channel MOSFETs Voltage controlled devices that allow control of high current outputs. SparkFun Products: SparkFun ESP32 Thing <https://www.sparkfun.com/products/13907> SparkFun ESP8266 Thing <https://www.sparkfun.com/products/13231> SparkFun Pi Servo HAT V2 <https://www.sparkfun.com/products/15316> DMG2305UX-7 (20V/4.2A/SOT23-3); PROD_ID: TRANS-14388
R1 R2 = SparkFun-Resistors:5.1KOHM; PROD_ID: RES-12083
R3 = SparkFun-Resistors:2.0KOHM: 2kΩ resistor A resistor is a passive two-terminal electrical component that implements electrical resistance as a circuit element. Resistors act to reduce current flow, and, at the same time, act to lower voltage levels within circuits. - Wikipedia; PROD_ID: RES-08296
R4 R9 R12 R13 R19 = SparkFun-Resistors:100KOHM: 100kΩ resistor A resistor is a passive two-terminal electrical component that implements electrical resistance as a circuit element. Resistors act to reduce current flow, and, at the same time, act to lower voltage levels within circuits. - Wikipedia; PROD_ID: RES-07828
R5 = SparkFun-Resistors:4.7KOHM: 4.7kΩ resistor A resistor is a passive two-terminal electrical component that implements electrical resistance as a circuit element. Resistors act to reduce current flow, and, at the same time, act to lower voltage levels within circuits. - Wikipedia; PROD_ID: RES-07857
R6 R7 = SparkFun-Resistors:10KOHM: 10kΩ resistor A resistor is a passive two-terminal electrical component that implements electrical resistance as a circuit element. Resistors act to reduce current flow, and, at the same time, act to lower voltage levels within circuits. - Wikipedia; PROD_ID: RES-00824
R8 R14 R15 = SparkFun-Resistors:2.2KOHM: 2.2kΩ resistor A resistor is a passive two-terminal electrical component that implements electrical resistance as a circuit element. Resistors act to reduce current flow, and, at the same time, act to lower voltage levels within circuits. - Wikipedia; PROD_ID: RES-08272
R10 = SparkFun-Resistors:20KOHM: 20kΩ resistor A resistor is a passive two-terminal electrical component that implements electrical resistance as a circuit element. Resistors act to reduce current flow, and, at the same time, act to lower voltage levels within circuits. - Wikipedia; PROD_ID: RES-09383
R11 R17 = SparkFun-Resistors:1KOHM: 1kΩ resistor A resistor is a passive two-terminal electrical component that implements electrical resistance as a circuit element. Resistors act to reduce current flow, and, at the same time, act to lower voltage levels within circuits. - Wikipedia; PROD_ID: RES-07856
R18 = SparkFun-Resistors:100OHM: 100Ω resistor A resistor is a passive two-terminal electrical component that implements electrical resistance as a circuit element. Resistors act to reduce current flow, and, at the same time, act to lower voltage levels within circuits. - Wikipedia; PROD_ID: RES-07863
S1 S2 = SparkFun-Switches:MOMENTARY-SWITCH-SPST: Momentary Switch (Pushbutton) - SPST Normally-open (NO) SPST momentary switches (buttons, pushbuttons). Variants PTH-12MM - 12mm square, through-hole Momentary Pushbutton Switch - 12mm Square <https://www.sparkfun.com/products/9190> (COM-09190) PTH-6.0MM, PTH-6.0MM-KIT - 6.0mm square, through-hole Mini Pushbutton Switch <https://www.sparkfun.com/products/97> (COM-00097) KIT package intended for soldering kit's - only one side of pads' copper is exposed. PTH-RIGHT-ANGLE-KIT - Right-angle, through-hole Right Angle Tactile Button <https://www.sparkfun.com/products/10791> - Used on SparkFun BigTime Watch Kit <https://www.sparkfun.com/products/11734> SMD-12MM - 12mm square, surface-mount Tactile Button - SMD (12mm) <https://www.sparkfun.com/products/12993> (COM-12993) Used on SparkFun PicoBoard <https://www.sparkfun.com/products/11888> SMD-4.5MM - 4.5mm Square Trackball Switch Used on SparkFun Blackberry Trackballer Breakout <https://www.sparkfun.com/products/13169> SMD-4.6MMX2.8MM - 4.60mm x 2.80mm, surface mount Used on SparkFun Pro Micro - RP2040 <https://www.sparkfun.com/products/17717> SMD-5.2MM, SMD-5.2-REDUNDANT - 5.2mm square, surface-mount Mini Pushbutton Switch - SMD <https://www.sparkfun.com/products/8720> (COM-08720) Used on Arduino Pro Mini <https://www.sparkfun.com/products/11114> REDUNDANT package connects both switch circuits together SMD-6.0X3.5MM - 6.0 x 3.5mm, surface mount Momentary Reset Switch SMD <https://www.sparkfun.com/products/8229> (COM-08229) SMD-6.2MM-TALL - 6.2mm square, surface mount Tactile Button - SMD (6mm) <https://www.sparkfun.com/products/12992> Used on SparkFun Digital Sandbox <https://www.sparkfun.com/products/12651> SMD-RIGHT-ANGLE - Right-angle, surface mount Used on SparkFun Block for Intel® Edison - Arduino <https://www.sparkfun.com/products/13036>; PROD_ID: SWCH-14139
TP1-TP4 = SparkFun-Connectors:TEST-POINT: SparkFun Test Points Bare copper test points for troubleshooting or In-Circuit-Testing. These are used by our Production team for verifying production board runs using pogo-pins on test beds. SparkFun Products: SparkFun LSM9DS1 Breakout <https://www.sparkfun.com/products/13284> SparkFun PSOC <https://www.sparkfun.com/products/13714> SparkFun Load Cell Amplifier <https://www.sparkfun.com/products/13879>
U1 = dip_switch:STG3856QTR; PROD_ID: IC-17058
U2 = SparkFun-IC-Power:MCP73831: MCP73831T Li-Ion, Li-Pol Controller Miniature single cell, fully integrated Li-Ion, Li-polymer charge management controller Datasheet <http://ww1.microchip.com/downloads/en/DeviceDoc/20001984g.pdf> SparkFun Products: SparkFun ESP32 Thing <https://www.sparkfun.com/products/13907> SparkFun 9DoF Razor IMU M0 <https://www.sparkfun.com/products/14001>; PROD_ID: IC-09995
U3 = SparkFun-DiscreteSemi:TVS_DIODE_ARRAY; PROD_ID: IC-13538
U4 = dip_switch:AP7347DQ-33W5-7: AP7347DQ - 500mA CMOS LDO Regulator w/ Enable The AP2112 is CMOS process low dropout linear regulator with enable function, the regulator delivers a guaranteed 600mA (min.) continuous load current. Features Output Voltage Accuracy: ±1% Output Current: 500mA Foldback Short Current Protection: 180mA Enable Function to Turn ON/OFF VOUT Low Dropout Voltage (3.3V): 270mV (Typ.) @IOUT=500mA Excellent Load Regulation: 22.5mV Excellent Line Regulation: 0.02%/V (Typ.) Low Quiescent Current: 60μA (Typ.) Low Standby Current: 0.01μA (Typ.) Low Output Noise: 60μVRMS PSRR: 100Hz -65dB, 1kHz -65dB OTSD Protection Stable with 1.0μF Flexible Cap: Ceramic, Tantalum and Aluminum Electrolytic Operation Temperature Range: -40°C to 85°C ESD: MM 400V, HBM 4000V; PROD_ID: VREG-17101
U5 = SparkFun-IC-Power:AP7361C-33FGE: AP7361C 3.3V LDO Regulator; PROD_ID: VREG-14094

## Net classes
0 default: width 0.178 mm, drill 0.305 mm
1 POWER: width 0.559 mm, drill 0.305 mm
2 Diff pairs: width 0.203 mm, drill 0.305 mm